# EAGLE design rc-light-controller-tlc5940-smd (EAGLE 5.12)
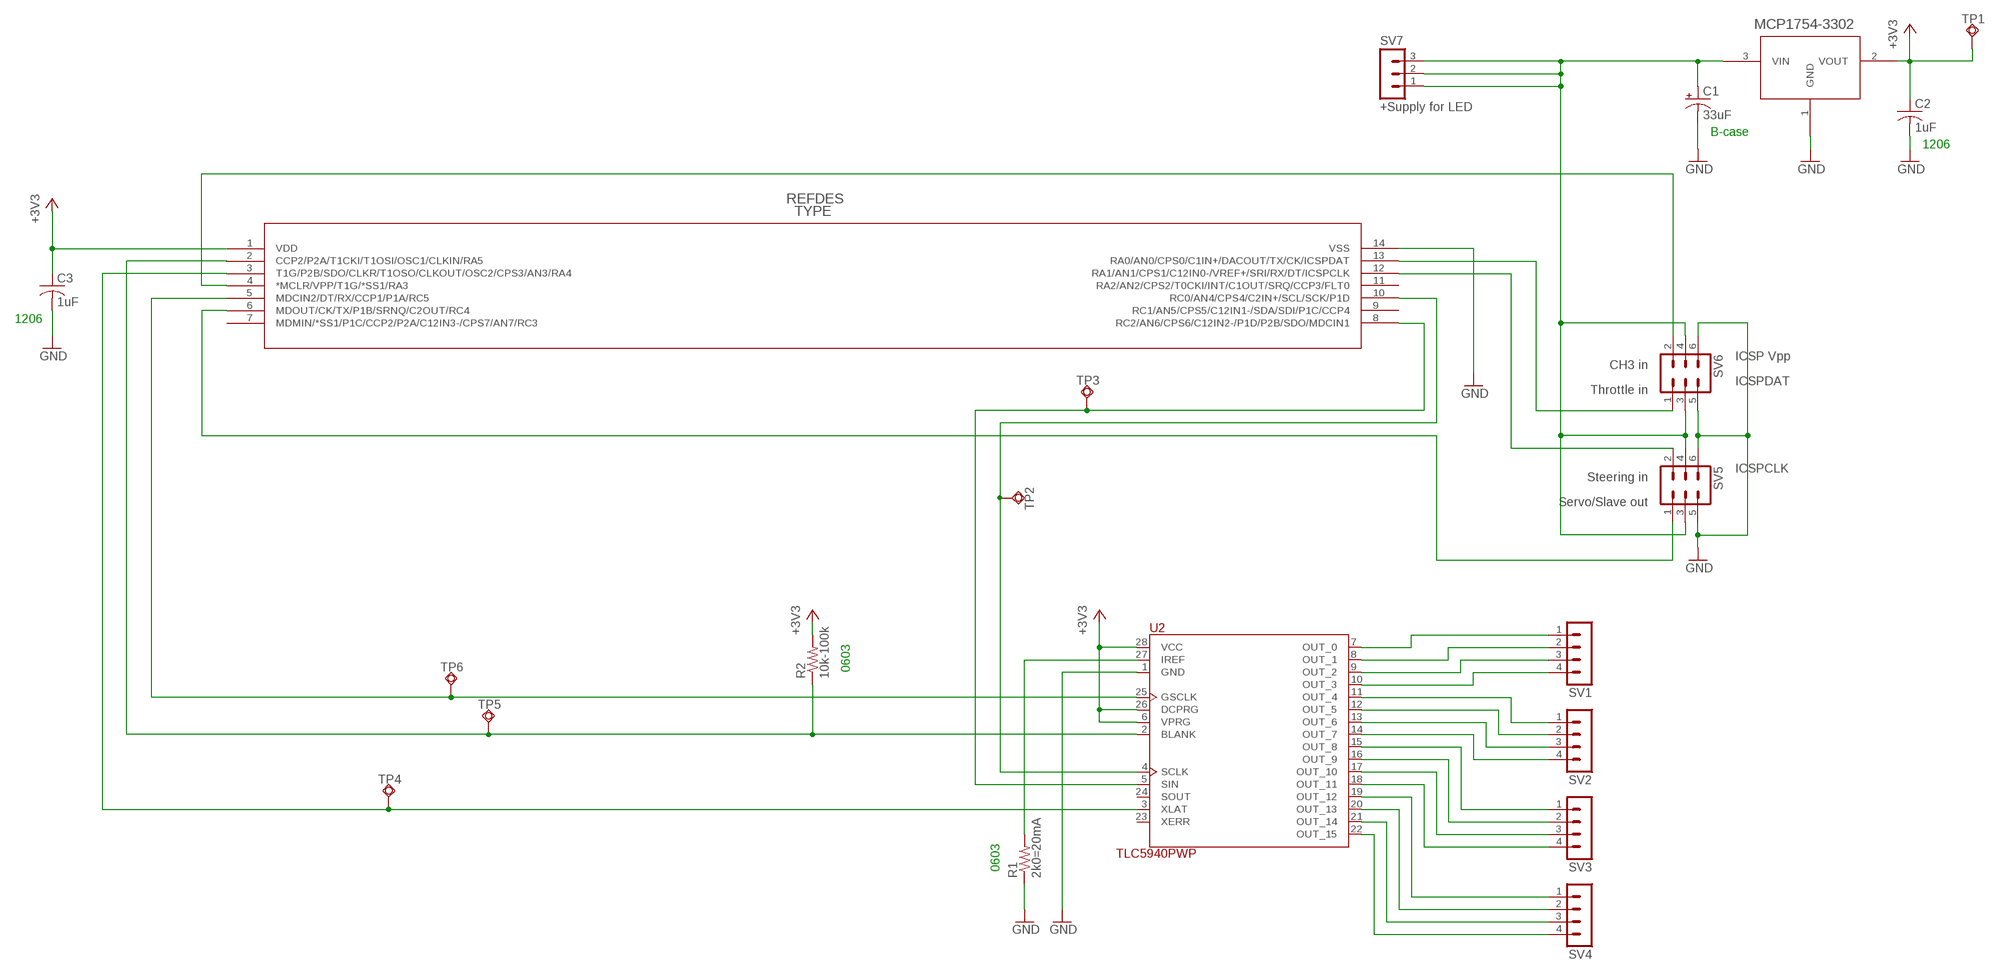
[diagram p0: schematic, sheet 1]

## Parts
C1  33uF  CPOL-USSMCB  [SMC_B]
C2  1uF  C-USC1206K  [C1206K]
C3  1uF  C-USC1206K  [C1206K]
R1  2k0=20mA  R-US_R0603  [R0603]
R2  10k-100k  R-US_R0603  [R0603]
SV1  MA04-1  [MA04-1]
SV2  MA04-1  [MA04-1]
SV3  MA04-1  [MA04-1]
SV4  MA04-1  [MA04-1]
SV5  MA03-2  [MA03-2]
SV6  MA03-2  [MA03-2]
SV7  +Supply for LED  MA03-1  [MA03-1]
TP1  3.3V  TPSQTP10R  [TP10R]
TP2  SCLK  TPSQTP10R  [TP10R]
TP3  SIN  TPSQTP10R  [TP10R]
TP4  XLAT  TPSQTP10R  [TP10R]
TP5  BLANK  TPSQTP10R  [TP10R]
TP6  GSCLK  TPSQTP10R  [TP10R]
U1  PIC16F1825-X_SL  [SOIC14-N_MC]
U2  TLC5940PWP  [SOP65P640X120-29N]
U$1  MCP1754X-XXXXX/C  [SOT-23A_MC]

## Nets
+3V3: C2.1 C3.1 R2.2 TP1.TP U1.1(VDD) U2.6(VPRG) U2.26(DCPRG) U2.28(VCC) U$1.2(VOUT)
BLANK: R2.1 TP5.TP U1.2(CCP2/P2A/T1CKI/T1OSI/OSC1/CLKIN/RA5) U2.2(BLANK)
CH3: SV6.2 U1.4(*MCLR/VPP/T1G/*SS1/RA3)
GND: C1.- C2.2 C3.2 R1.1 SV5.5 SV5.6 SV6.5 SV6.6 U1.14(VSS) U2.1(GND) U$1.1(GND)
GSCLK: TP6.TP U1.5(MDCIN2/DT/RX/CCP1/P1A/RC5) U2.25(GSCLK)
IREF: R1.2 U2.27(IREF)
N$1: SV1.1 U2.7(OUT_0)
N$2: SV1.2 U2.8(OUT_1)
N$3: SV1.3 U2.9(OUT_2)
N$4: SV1.4 U2.10(OUT_3)
N$5: SV4.4 U2.22(OUT_15)
N$6: SV4.3 U2.21(OUT_14)
N$7: SV4.2 U2.20(OUT_13)
N$8: SV4.1 U2.19(OUT_12)
N$9: SV3.4 U2.18(OUT_11)
N$10: SV3.3 U2.17(OUT_10)
N$11: SV3.2 U2.16(OUT_9)
N$12: SV3.1 U2.15(OUT_8)
N$13: SV2.4 U2.14(OUT_7)
N$14: SV2.3 U2.13(OUT_6)
N$15: SV2.2 U2.12(OUT_5)
N$16: SV2.1 U2.11(OUT_4)
SCLK: TP2.TP U1.10(RC0/AN4/CPS4/C2IN+/SCL/SCK/P1D) U2.4(SCLK)
SIN: TP3.TP U1.8(RC2/AN6/CPS6/C12IN2-/P1D/P2B/SDO/MDCIN1) U2.5(SIN)
SLAT: TP4.TP U1.3(T1G/P2B/SDO/CLKR/T1OSO/CLKOUT/OSC2/CPS3/AN3/RA4) U2.3(XLAT)
SLAVEOUT: SV5.1 U1.6(MDOUT/CK/TX/P1B/SRNQ/C2OUT/RC4)
ST: SV5.2 U1.12(RA1/AN1/CPS1/C12IN0-/VREF+/SRI/RX/DT/ICSPCLK)
TH: SV6.1 U1.13(RA0/AN0/CPS0/C1IN+/DACOUT/TX/CK/ICSPDAT)
VIN: C1.+ SV5.3 SV5.4 SV6.3 SV6.4 SV7.1 SV7.2 SV7.3 U$1.3(VIN)
Unconnected: U1.7(MDMIN/*SS1/P1C/CCP2/P2A/C12IN3-/CPS7/AN7/RC3) U1.9(RC1/AN5/CPS5/C12IN1-/SDA/SDI/P1C/CCP4) U1.11(RA2/AN2/CPS2/T0CKI/INT/C1OUT/SRQ/CCP3/FLT0) U2.23(XERR) U2.24(SOUT)

## Notes on the sheet
- B-case
- 1206
- 1206
- CH3 in | ICSP Vpp
- Throttle in | ICSPDAT
- Steering in | ICSPCLK
- Servo/Slave out
- 0603
- 0603

## Library data of the parts
C1 = rcl:CPOL-US: POLARIZED CAPACITOR, American symbol
C2 C3 = resistor:C-US: CAPACITOR, American symbol
R1 R2 = rcl:R-US_: RESISTOR, American symbol
SV1-SV4 = con-lstb-modified:MA04-1: PIN HEADER; OC_FARNELL: unknown; OC_NEWARK: unknown
SV5 SV6 = con-lstb-modified:MA03-2: PIN HEADER; OC_FARNELL: unknown; OC_NEWARK: unknown
SV7 = con-lstb-modified:MA03-1: PIN HEADER; OC_FARNELL: unknown; OC_NEWARK: unknown
TP1-TP6 = testpad:TPSQ: Test pad
U1 = PIC16F1825:PIC16F1825-X_SL
U2 = tlc5940:TLC5940: 16 CHANNEL LED DRIVER WITH DOT CORRECTION AND GRAYSCALE PWM CONTROL; MPN: TLC5940PWP; PACKAGE: HTSSOP-28; SUPPLIER: Texas Instruments
U$1 = MCP1754:MCP1754X-XXXXX/C

## Net classes
0 default: width 0.254 mm, drill 0.508 mm, clearance 0.254 mm

## Board
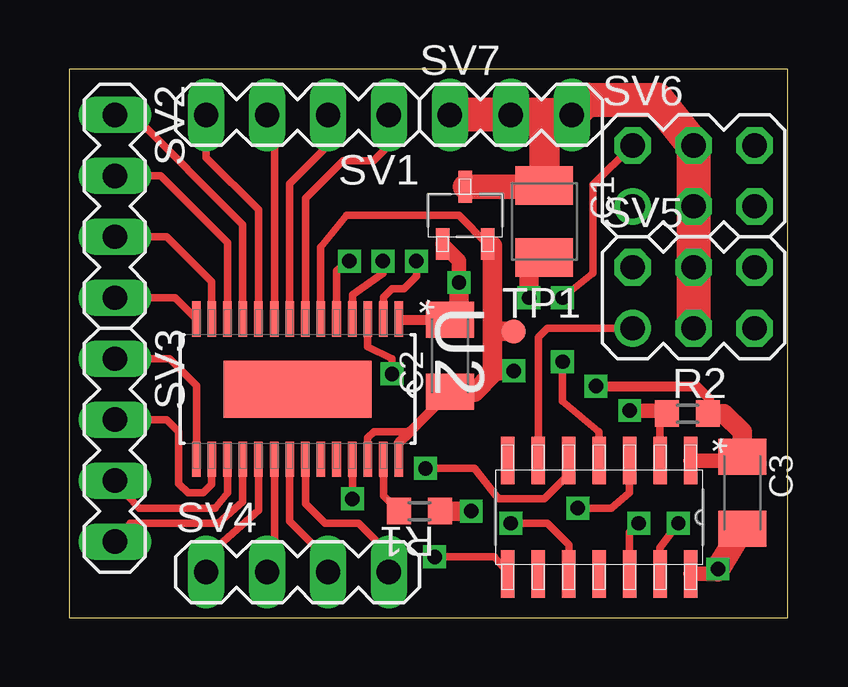
[diagram p1: board, top side]
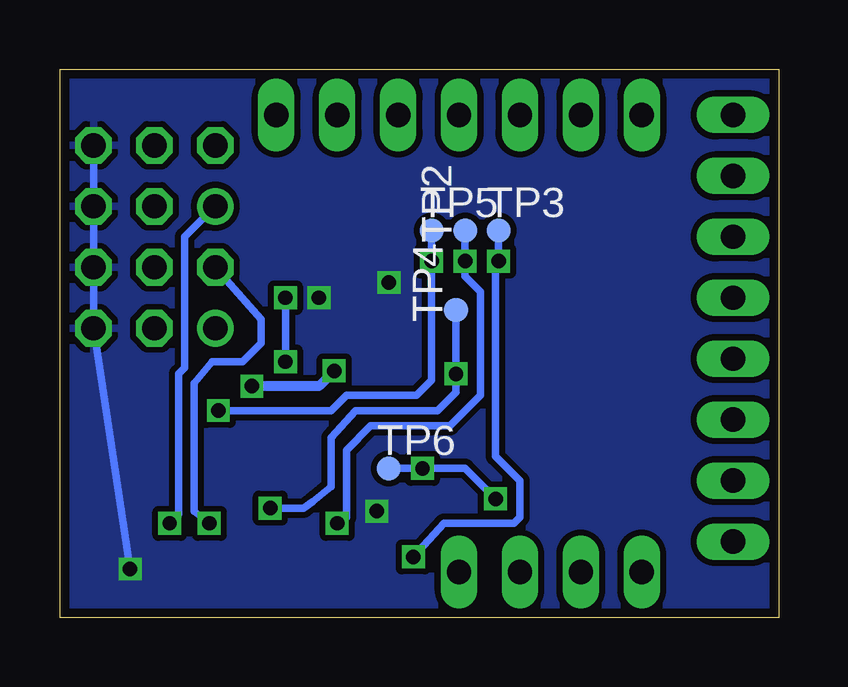
[diagram p2: board, bottom side, seen from below]

Size 29.97 x 22.86 mm. Coordinates in mm from the lower left corner, seen from the top.
Outline: 0,0 29.97,0 29.97,22.86 0,22.86 0,0
Copper layers (1*16): Top 0.0356mm / dielectric 1.5011mm / Bottom 0.0356mm
Design rules "LaenPCBOrder (OSH Park)": minimum track width 6mil, minimum drill 13mil, track to track 6mil, track to pad 6mil, pad to pad 6mil, via to via 6mil, smd to smd 6mil, copper to edge 15mil, drill to drill 6mil, minimum pad ring 7mil, minimum via ring 7mil, stop-mask expansion 4mil, vias tented up to drill 0mil, thermal gap 10mil

### Footprints (pad centres in the part's own frame; a part is rotated, then mirrored left to right if it is on the bottom)
SMC_B = smd 1.6 x 2.4: + -1.5,0; - 1.5,0
C1206K = smd 1.5 x 2: 1 -1.5,0; 2 1.5,0
R0603 = smd 1 x 1.1: 1 -0.85,0; 2 0.85,0
MA04-1 = drill 1.016 long: 1 -3.81,0; 2 -1.27,0; 3 1.27,0; 4 3.81,0
MA03-2 = drill 1.016 round: 1 -2.54,-1.27 | drill 1.016 octagon: 2 -2.54,1.27; 3 0,-1.27; 4 0,1.27; 5 2.54,-1.27; 6 2.54,1.27
MA03-1 = drill 1.016 long: 1 -2.54,0; 2 0,0; 3 2.54,0
TP10R = smd 1 x 1: TP 0,0
SOIC14-N_MC = smd 1.981 x 0.559: 1 -2.362,3.81; 2 -2.362,2.54; 3 -2.362,1.27; 4 -2.362,0; 5 -2.362,-1.27; 6 -2.362,-2.54; 7 -2.362,-3.81; 8 2.362,-3.81; 9 2.362,-2.54; 10 2.362,-1.27; 11 2.362,0; 12 2.362,1.27; 13 2.362,2.54; 14 2.362,3.81
SOP65P640X120-29N = smd 1.473 x 0.356: 1 -2.921,4.216; 2 -2.921,3.581; 3 -2.921,2.921; 4 -2.921,2.286; 5 -2.921,1.626; 6 -2.921,0.965; 7 -2.921,0.33; 8 -2.921,-0.33; 9 -2.921,-0.965; 10 -2.921,-1.626; 11 -2.921,-2.286; 12 -2.921,-2.921; 13 -2.921,-3.581; 14 -2.921,-4.216; 15 2.921,-4.216; 16 2.921,-3.581; 17 2.921,-2.921; 18 2.921,-2.286; 19 2.921,-1.626; 20 2.921,-0.965; 21 2.921,-0.33; 22 2.921,0.33; 23 2.921,0.965; 24 2.921,1.626; 25 2.921,2.286; 26 2.921,2.921; 27 2.921,3.581; 28 2.921,4.216 | smd 2.388 x 6.172: 29 0,0
SOT-23A_MC = smd 0.559 x 1.321: 1 -0.94,-1.194; 2 0.94,-1.194; 3 0,1.194

### Placement (x,y rotation side)
C1  19.81,16.51 270 top
C2  15.88,10.92 90 top
C3  28.07,5.21 270 top
R1  14.61,4.44 180 top
R2  25.78,8.51 0 top
SV1  9.53,20.95 180 top
SV2  1.91,17.14 270 top
SV3  1.91,6.98 270 top
SV4  9.53,1.91 0 top
SV5  26.04,13.34 0 top
SV6  26.04,18.41 0 top
SV7  18.41,20.95 0 top
TP1  18.54,11.94 0 top
TP2  13.08,16.13 90 bottom
TP3  11.68,16.13 0 bottom
TP4  13.46,12.83 90 bottom
TP5  14.48,16.13 0 bottom
TP6  16.26,6.22 0 bottom
U1  22.1,4.19 270 top
U2  9.53,9.53 270 top
U$1  16.51,16.76 0 top

### Tracks (layer width: path | path; a pad name or v marks a point on that pad's centre or on a via)
+3V3  (via drill 0.6)
  Top 0.305: 13.74,7.29 U2.28 | U2.6 10.49,15.44 11.56,16.76 16.26,16.76 U$1.2 17.65,15.49 | U2.26 12.45,7.49 12.71,7.76 14.21,7.76 | C3.1 27.91,6.55 | 26.54,8.6 R2.2 26.67,8.55
  Top 0.406: 13.74,7.29 14.21,7.76 C2.1 | v21.97,9.65 26.16,9.65 26.67,9.14 26.67,8.55
  Top 0.61: 27.91,6.55 U1.1
  Top 0.813: R2.2 27.3,8.51 28.07,7.75 C3.1 | 17.65,11.94 17.65,15.49 | 17.65,11.94 TP1.TP | 17.65,10.29 17.65,11.94 | 17.65,10.29 17.65,10.16 16.89,9.4 15.9,9.4 C2.1 | 17.65,10.29 v18.54,10.29
  Bottom 0.406: v21.97,9.65 19.18,9.65 v18.54,10.29
BLANK  (via drill 0.6)
  Top 0.305: U1.2 24.64,8.22 R2.1 24.8,8.64 | U2.2 13.11,13.36 13.46,13.72 13.97,13.72 14.48,14.22 v14.48,14.86
  Top 0.61: v23.37,8.64 24.8,8.64
  Bottom 0.305: v23.37,8.64 18.67,8.64 18.03,9.27 15.11,9.27 14.48,9.91 v14.48,14.86 TP5.TP
CH3  (via drill 0.6)
  Top 0.305: v20.57,10.67 20.57,9.02 22.1,7.75 U1.4 | v20.57,13.34 21.84,14.35 21.84,18.03 SV6.2
  Bottom 0.305: v20.57,10.67 v20.57,13.34
GND  (via drill 0.6)
  Top 0.305: U$1.1 15.62,15.52 | U2.1 13.77,12.42 | C1.- 19.18,14.38 | 27.13,1.83 v27.05,2.03
  Top 0.406: 13.77,12.42 C2.2 16.26,12.8
  Top 0.61: C3.2 27.59,3.23 | v16.26,13.97 16.26,14.88 U$1.1 | U1.14 27.13,1.83
  Top 0.813: R1.1 v16.76,4.44 | 19.18,14.38 v19.18,13.34 | 16.26,12.8 v16.26,13.97
  Top 1.016: v27.05,2.03 C3.2
  Bottom 0.305: SV6.6 SV6.5 SV5.6 SV5.5 v27.05,2.03
  pour Bottom: 0.13,23.24 30.1,23.24 30.73,22.22 30.73,0 30.35,-0.38 -1.02,-0.38 -1.65,0 -1.4,22.1 -1.02,22.48 -0.38,22.73
GSCLK  (via drill 0.6)
  Top 0.305: v11.81,4.95 U2.25 | U1.5 20.95,6.48 20.7,6.22 20.7,5.84 19.81,4.95 17.91,4.95 16.89,6.22 v14.86,6.22
  Bottom 0.305: v11.81,4.95 13.08,6.22 v14.86,6.22 TP6.TP
IREF
  Top 0.305: U2.27 13.11,5.09 R1.2
N$1
  Top 0.305: U2.7 9.86,17.47 11.43,19.05 12.7,19.05 13.34,19.68 SV1.1
N$2
  Top 0.305: U2.8 9.2,18.08 10.79,19.68 SV1.2
N$3
  Top 0.305: U2.9 8.56,20.65 SV1.3
N$4
  Top 0.305: U2.10 7.9,16.99 5.71,19.18 SV1.4
N$5
  Top 0.305: U2.22 9.86,4.75 10.67,3.94 12.07,3.94 13.34,2.67 SV4.4
N$6
  Top 0.305: U2.21 9.2,4.01 10.79,2.41 SV4.3
N$7
  Top 0.305: U2.20 8.56,2.21 SV4.2
N$8
  Top 0.305: U2.19 7.9,4.47 5.71,2.54 SV4.1
N$9
  Top 0.305: U2.18 7.24,4.83 6.22,3.94 2.54,3.94 SV3.4
N$10
  Top 0.305: U2.17 6.6,5.21 6.1,4.57 2.92,4.57 SV3.3
N$11
  Top 0.305: U2.16 5.94,5.56 5.59,5.21 4.95,5.21 4.57,5.59 4.57,7.75 4.06,8.26 SV3.2
N$12
  Top 0.305: U2.15 5.31,9.68 4.19,10.79 SV3.1
N$13
  Top 0.305: U2.14 4.42,13.34 SV2.4
N$14
  Top 0.305: U2.13 5.94,14 4.06,15.88 SV2.3
N$15
  Top 0.305: U2.12 6.6,15.62 3.81,18.41 SV2.2
N$16
  Top 0.305: U2.11 7.24,16.38 2.67,20.95 SV2.1
SCLK  (via drill 0.6)
  Top 0.305: v13.08,14.86 13.08,14.35 11.81,13.46 U2.4 | v18.41,3.94 19.94,3.94 20.83,3.05 U1.10
  Bottom 0.305: v18.41,3.94 18.03,4.19 18.03,6.98 17.02,8 13.72,8 12.45,9.27 12.45,13.59 13.08,14.22 v13.08,14.86 TP2.TP
SIN  (via drill 0.6)
  Top 0.305: U1.8 17.73,2.54 v15.24,2.54 | v11.68,14.86 11.15,14.45 U2.5
  Bottom 0.305: v15.24,2.54 13.97,3.94 11.05,3.94 10.79,4.19 10.79,5.71 11.81,6.73 11.81,14.73 v11.68,14.86 TP3.TP
SLAT  (via drill 0.6)
  Top 0.305: U2.3 12.45,11.3 13.46,10.79 v13.46,10.16 | U1.3 23.37,5.21 22.61,4.57 v21.21,4.57
  Bottom 0.305: v21.21,4.57 19.81,4.57 19.43,4.83 18.67,5.46 18.67,7.49 17.65,8.64 14.22,8.64 13.46,9.4 v13.46,10.16 TP4.TP
SLAVEOUT
  Top 0.305: SV5.1 19.94,12.07 19.56,11.68 U1.6
ST  (via drill 0.6)
  Top 0.305: U1.12 23.37,3.56 v23.75,3.94
  Bottom 0.305: SV5.2 21.59,12.45 21.59,11.43 22.35,10.67 23.62,10.67 24.38,9.78 24.38,4.44 v23.75,3.94
TH  (via drill 0.6)
  Top 0.305: 24.77,1.65 U1.13 24.64,2.92 v25.4,3.94
  Bottom 0.305: SV6.1 24.77,15.88 24.77,10.41 25.02,10.16 25.02,4.32 v25.4,3.94
VIN
  Top 0.305: 19.76,17.96 C1.+
  Top 1.016: U$1.3 19.76,17.96
  Top 1.27: C1.+ 19.81,20.83 19.68,20.95
  Top 1.422: SV7.1 SV7.2 19.68,20.95 SV7.3 21.59,21.59 24.51,21.59 SV6.4 SV6.3 SV5.4 SV5.3

### Text on the board
tValues: - + S | 4 | 5 | 3 | 2 | 1 | OUT0 | + | IN | + | + | + | MCP1754 3V3 | 6 | GND | OUT | 7 | 8 | 9 | 10 | PIC16F1825 | 11 | 12 | 15
bValues: - + S | CH3/Vpp | TH/DAT | ST/Rx/CLK | Servo/Tx | Rev. 3 | http://goo.gl/pI1RR | RC Light Controller | LANE Boys RC